# EAGLE design KGM EEPROM v1.0 (EAGLE 5.11)
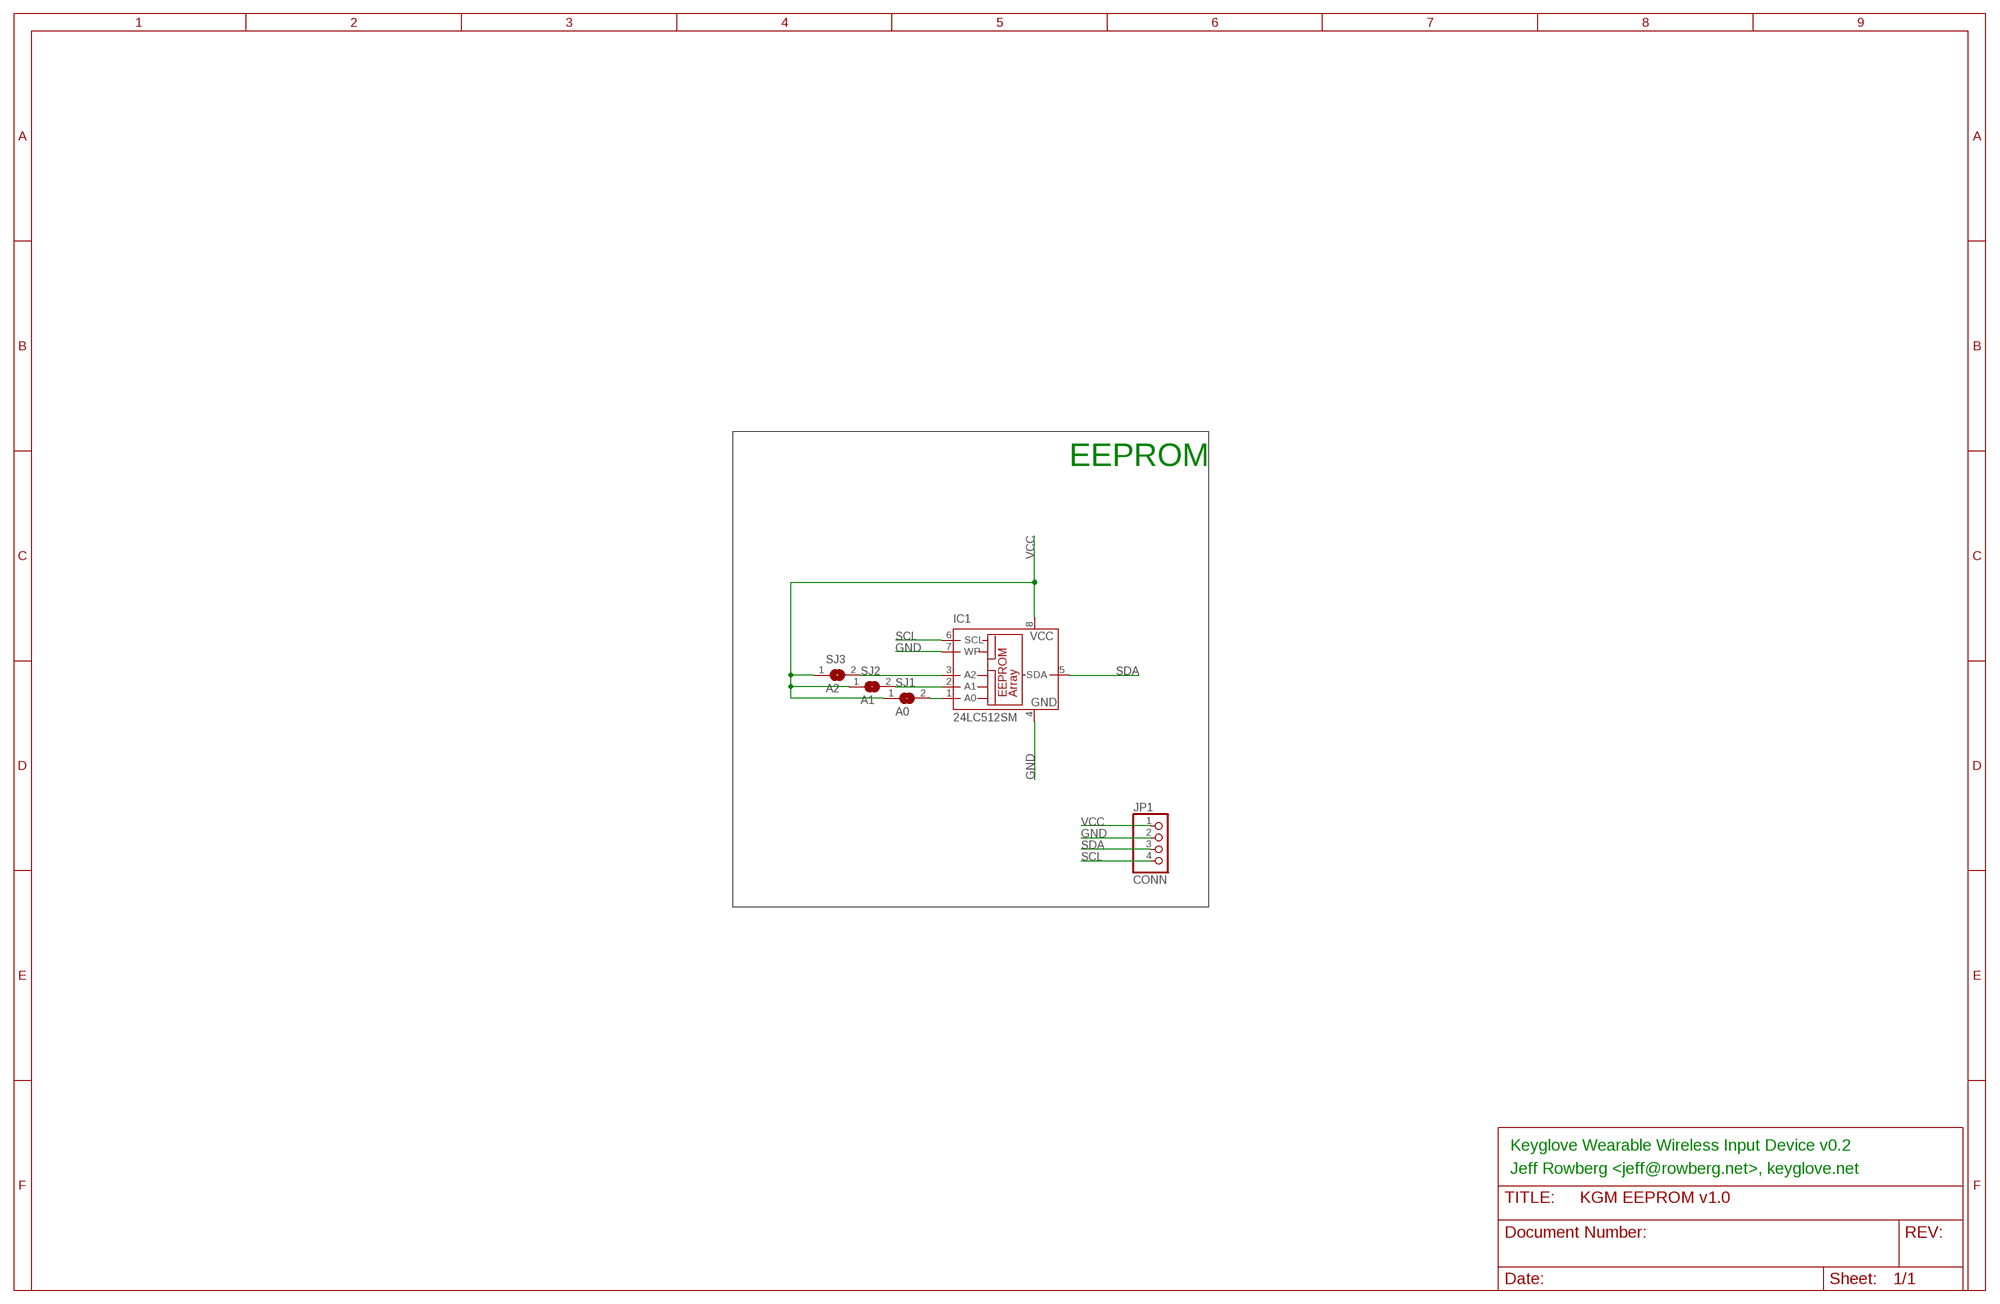
[diagram p0: schematic, sheet 1]

## Parts
IC1  24LC512SM  24LC128SM  [SO-08M]
JP1  CONN  PINHD-1X4  [1X04]
SJ1  A0  SJ  [SJ]
SJ2  A1  SJ  [SJ]
SJ3  A2  SJ  [SJ]

## Nets
GND [power]: IC1.4(GND) IC1.7(WP) JP1.2
N$5: IC1.1(A0) SJ1.2
N$6: IC1.2(A1) SJ2.2
N$7: IC1.3(A2) SJ3.2
SCL: IC1.6(SCL) JP1.4
SDA: IC1.5(SDA) JP1.3
VCC [power]: IC1.8(VCC) JP1.1 SJ1.1 SJ2.1 SJ3.1

## Notes on the sheet
- EEPROM
- Keyglove Wearable Wireless Input Device v0.2
- Jeff Rowberg <jeff@rowberg.net>, keyglove.net

## Library data of the parts
IC1 = microchip:24*: Serial EEPROM I2C; MF: MICROCHIP; MPN: 24LC128-I/SM; OC_FARNELL: 9757937; OC_NEWARK: 92C7134
JP1 = sf-pinhead:PINHD-1X4: PIN HEADER
SJ1-SJ3 = jumper:SJ: SMD solder JUMPER

## Net classes
0 default: width 0.152 mm, drill 0.305 mm, clearance 0.152 mm
1 power: width 0.254 mm, drill 0.305 mm, clearance 0.152 mm

## Board
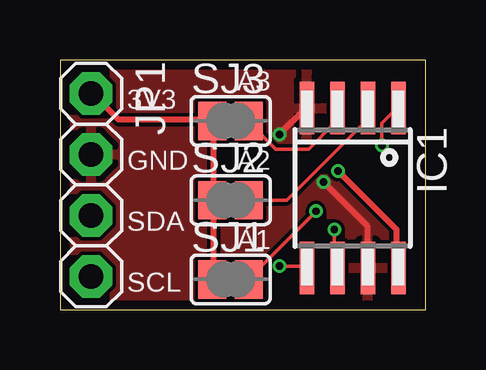
[diagram p1: board, top side]
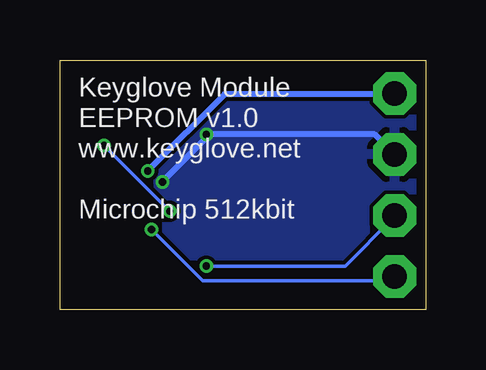
[diagram p2: board, bottom side, seen from below]

Size 15.24 x 10.41 mm. Coordinates in mm from the lower left corner, seen from the top.
Outline: 0,0 15.24,0 15.24,10.41 0,10.41 0,0
Copper layers (1*16): Top 0.0356mm / dielectric 1.5011mm / Bottom 0.0356mm
Design rules "PCBWingOrder *": minimum track width 6mil, minimum drill 12mil, track to track 6mil, track to pad 6mil, pad to pad 6mil, via to via 6mil, smd to smd 6mil, copper to edge 15mil, drill to drill 6mil, minimum pad ring 6mil, minimum via ring 5mil, stop-mask expansion 4mil, vias tented up to drill 20mil, thermal gap 10mil

### Footprints (pad centres in the part's own frame; a part is rotated, then mirrored left to right if it is on the bottom)
SO-08M = smd 0.6 x 2.2: 1 -1.905,-3.33; 2 -0.635,-3.33; 3 0.635,-3.33; 4 1.905,-3.33; 5 1.905,3.33; 6 0.635,3.33; 7 -0.635,3.33; 8 -1.905,3.33
1X04 = drill 1.016 pad 1.778 octagon: 1 -3.81,0; 2 -1.27,0; 3 1.27,0; 4 3.81,0
SJ = smd 1.168 x 1.6: 1 -0.762,0; 2 0.762,0

### Placement (x,y rotation side)
IC1  12.19,5.08 180 top
JP1  1.3,5.21 270 top
SJ1  7.11,1.27 0 top
SJ2  7.11,4.57 0 top
SJ3  7.11,7.87 0 top

### Tracks (layer width: path | path; a pad name or v marks a point on that pad's centre or on a via)
GND  (via drill 0.3)
  Top 0.254: v9.14,7.32 10.21,8.38 IC1.4 | v10.97,5.33 12.8,3.5 12.8,1.83 IC1.7
  Bottom 0.254: 8.99,7.32 2.13,7.32 JP1.2 | 8.99,7.32 v10.97,5.33 | 8.99,7.32 v9.14,7.32
  pour Bottom: 0.25,10.16 15.24,10.16 15.24,0.25 0.25,0.25
  pour Top: 0.25,10.16 15.24,10.16 15.24,0.25 0.25,0.25
N$5  (via drill 0.3)
  Top 0.152: v10.67,4.12 7.92,1.37 SJ1.2 | v13.41,6.86 13.41,7.77 14.02,8.38 IC1.1
  Bottom 0.152: v10.67,4.12 v13.41,6.86
N$6
  Top 0.152: SJ2.2 9.45,4.57 12.8,7.92 12.8,8.38 IC1.2
N$7
  Top 0.152: SJ3.2 7.92,7.77 8.99,6.71 10.36,6.71 11.43,7.77 11.43,8.38 IC1.3
SCL  (via drill 0.3)
  Top 0.152: v11.43,3.35 11.43,1.83 IC1.6
  Bottom 0.152: v11.43,3.35 9.3,1.22 1.52,1.22 1.37,1.37 JP1.4
SDA  (via drill 0.3)
  Top 0.152: v9.14,1.83 10.21,1.83 IC1.5
  Bottom 0.152: v9.14,1.83 3.35,1.83 1.37,3.81 JP1.3
VCC  (via drill 0.3)
  Top 0.254: 6.4,4.57 6.4,1.37 SJ1.1 | 6.4,4.57 6.4,7.77 SJ3.1 6.25,7.92 2.44,7.92 1.37,8.99 JP1.1 | 6.4,4.57 SJ2.1 | v11.58,5.79 14.02,3.35 14.02,1.83 IC1.8
  Bottom 0.254: v11.58,5.79 8.38,8.99 1.37,8.99 JP1.1

### Text on the board
tPlace: A3 | 3V3 | GND | A2 | SDA | A1 | SCL
bPlace: Keyglove Module | EEPROM v1.0 | www.keyglove.net | Microchip 512kbit